# Altium project BluetoothGateway.PrjPcb
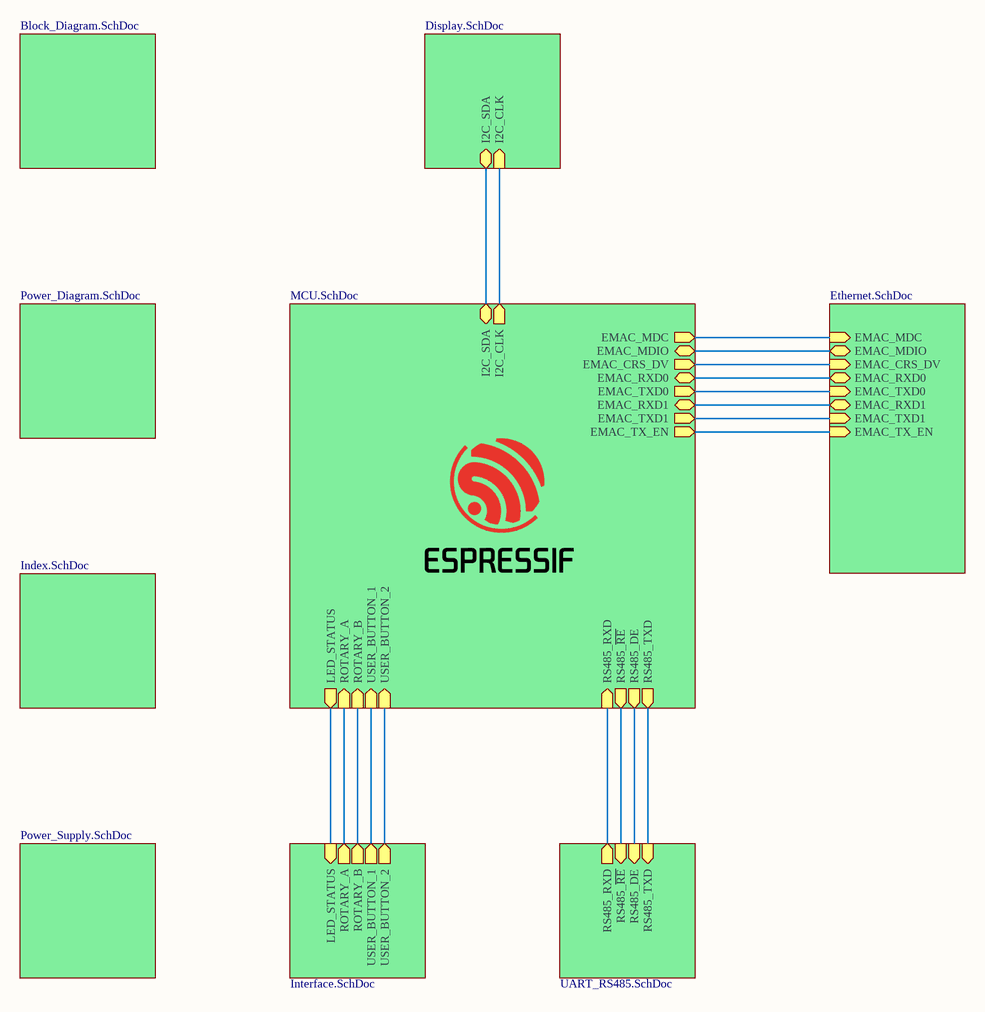
[diagram p0: Overview_Schematic.SchDoc]
10 sheets, 117 parts. Net scope: hierarchical (ports join the sheet entries above them; power ports are global).
Board file: BluetoothGateway_V1.0.0.PcbDoc
Sheets:
  Overview_Schematic.SchDoc
    Designator = Block_Diagram.SchDoc
    Designator = Power_Diagram.SchDoc
    Designator = MCU.SchDoc
    Designator = Ethernet.SchDoc
    Designator = UART_RS485.SchDoc
    Designator = Index.SchDoc
    Designator = Power_Supply.SchDoc
    Designator = Display.SchDoc
    Designator = Interface.SchDoc

## Sheet Overview_Schematic.SchDoc: Bluetooth Gateway
size A3; CheckedBy: QUOCTHANG; DrawnBy: DONGKHOA; Revision: V1.0.0; SheetNumber: 1; SheetTotal: 10

### Sub-sheets
Designator = Block_Diagram.SchDoc: no entries
Designator = Power_Diagram.SchDoc: no entries
Designator = MCU.SchDoc: EMAC_MDC (out), EMAC_MDIO (bidir), EMAC_CRS_DV (out), EMAC_RXD0 (bidir), EMAC_RXD1 (bidir), EMAC_TXD0 (out), EMAC_TXD1 (out), EMAC_TX_EN (out), I2C_SDA (bidir), I2C_CLK (out), LED_STATUS (out), ROTARY_A (in), ROTARY_B (in), USER_BUTTON_1 (in), USER_BUTTON_2 (in), RS485_RXD (in), RS485_~{RE} (out), RS485_DE (out), RS485_TXD (out)
Designator = Ethernet.SchDoc: EMAC_MDC (in), EMAC_MDIO (bidir), EMAC_CRS_DV (in), EMAC_RXD0 (bidir), EMAC_RXD1 (bidir), EMAC_TXD0 (in), EMAC_TXD1 (in), EMAC_TX_EN (in)
Designator = UART_RS485.SchDoc: RS485_RXD (out), RS485_~{RE} (in), RS485_DE (in), RS485_TXD (in)
Designator = Index.SchDoc: no entries
Designator = Power_Supply.SchDoc: no entries
Designator = Display.SchDoc: I2C_SDA (bidir), I2C_CLK (in)
Designator = Interface.SchDoc: LED_STATUS (in), ROTARY_A (out), ROTARY_B (out), USER_BUTTON_1 (out), USER_BUTTON_2 (out)

### Nets
NetC33_2: sheet Designator/USER_BUTTON_2, sheet Designator/USER_BUTTON_2
NetC34_2: sheet Designator/USER_BUTTON_1, sheet Designator/USER_BUTTON_1
NetC35_2: sheet Designator/ROTARY_B, sheet Designator/ROTARY_B
NetC36_2: sheet Designator/ROTARY_A, sheet Designator/ROTARY_A
NetJ3_1: sheet Designator/I2C_CLK, sheet Designator/I2C_CLK
NetJ3_2: sheet Designator/I2C_SDA, sheet Designator/I2C_SDA
NetR17_1: sheet Designator/EMAC_MDIO, sheet Designator/EMAC_MDIO
NetR18_1: sheet Designator/EMAC_CRS_DV, sheet Designator/EMAC_CRS_DV
NetR20_2: sheet Designator/EMAC_RXD0, sheet Designator/EMAC_RXD0
NetR21_2: sheet Designator/EMAC_RXD1, sheet Designator/EMAC_RXD1
NetR42_1: sheet Designator/LED_STATUS, sheet Designator/LED_STATUS
NetU3_8: sheet Designator/RS485_TXD, sheet Designator/RS485_TXD
NetU3_9: sheet Designator/RS485_DE, sheet Designator/RS485_DE
NetU3_10: sheet Designator/RS485_~{RE}, sheet Designator/RS485_~{RE}
NetU3_11: sheet Designator/RS485_RXD, sheet Designator/RS485_RXD
NetU3_23: sheet Designator/EMAC_TXD1, sheet Designator/EMAC_TXD1
NetU3_26: sheet Designator/EMAC_TXD0, sheet Designator/EMAC_TXD0
NetU3_30: sheet Designator/EMAC_TX_EN, sheet Designator/EMAC_TX_EN
NetU3_31: sheet Designator/EMAC_MDC, sheet Designator/EMAC_MDC

### Notes on the sheet
- Project Name
- Size
- A3
- Revision
- Checked By:
- Drawn By:
- Date:
- File:
- Last Modified:
- Sheet
- of

## Sheet Block_Diagram.SchDoc: Bluetooth Gateway
size A; CheckedBy: QUOCTHANG; DrawnBy: DONGKHOA; Revision: V1.0.0; SheetNumber: 2; SheetTotal: 10

### Notes on the sheet
- Project Name
- Size
- A4
- Revision
- Checked By:
- Drawn By:
- Date:
- File:
- Last Modified:
- Sheet
- of
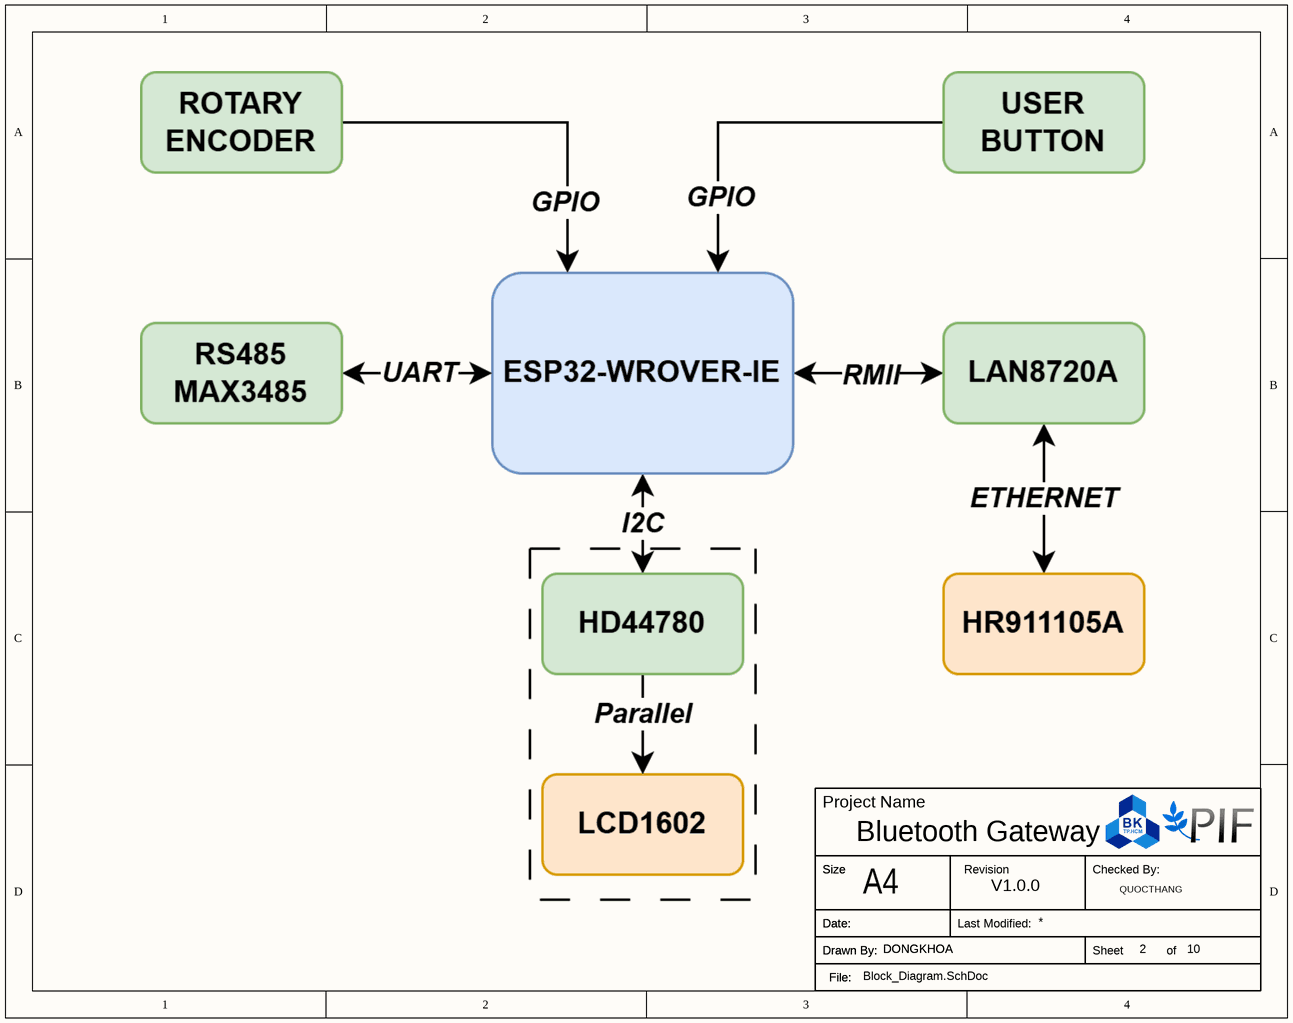
[diagram p1: Block_Diagram.SchDoc]

## Sheet Power_Diagram.SchDoc: Bluetooth Gateway
size A; CheckedBy: QUOCTHANG; DrawnBy: DONGKHOA; Revision: V1.0.0; SheetNumber: 3; SheetTotal: 10

### Notes on the sheet
- Project Name
- Size
- A4
- Revision
- Checked By:
- Drawn By:
- Date:
- File:
- Last Modified:
- Sheet
- of
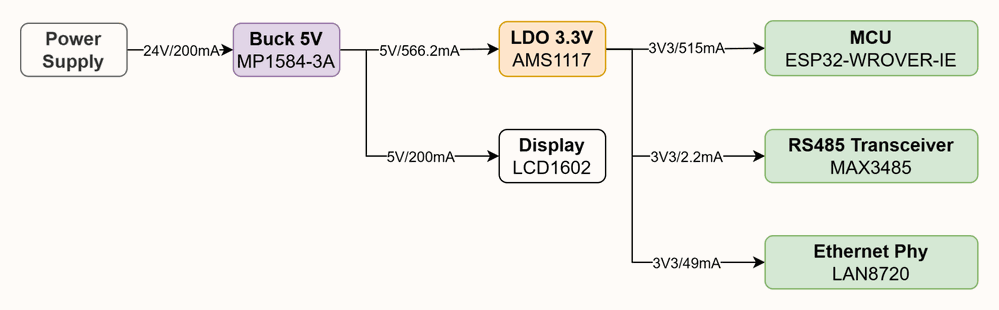
[diagram p2: Power_Diagram.SchDoc]

## Sheet MCU.SchDoc: Bluetooth Gateway
size A; CheckedBy: QUOCTHANG; DrawnBy: DONGKHOA; Revision: V1.0.0; SheetNumber: 6; SheetTotal: 10
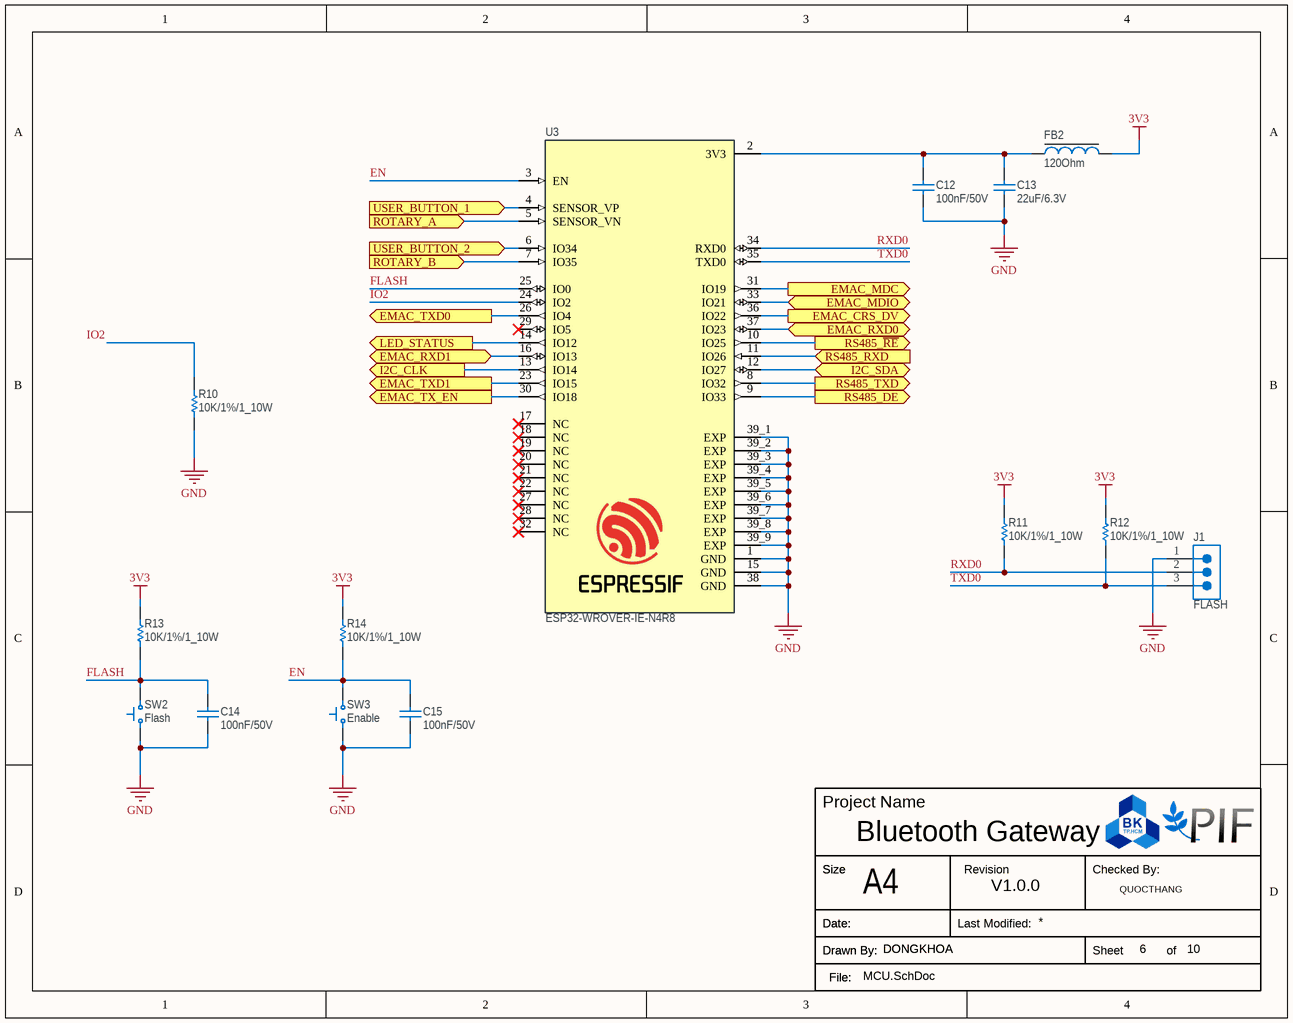
[diagram p3: MCU.SchDoc]

### Parts
C12  100nF/50V  [CAP_0805]
C13  22uF/6.3V  [CAP_0805]
C14  100nF/50V  [CAP_0603]
C15  100nF/50V  [CAP_0603]
FB2  120Ohm  [Ferrite_Bead_0805]
J1  FLASH  [Header_2.54mm_3P]
R10  10K/1%/1_10W  [Resistor_0603]
R11  10K/1%/1_10W  [Resistor_0603]
R12  10K/1%/1_10W  [Resistor_0603]
R13  10K/1%/1_10W  [Resistor_0603]
R14  10K/1%/1_10W  [Resistor_0603]
SW2  Flash  [Button_3x4mm_SMD_2P]
SW3  Enable  [Button_3x4mm_SMD_2P]
U3  ESP32-WROVER-IE-N4R8  [XCVR_ESP32-WROVER-IE-N4R8]

### Ports
EMAC_CRS_DV (out, see Overview_Schematic[5B], Ethernet[7B]), EMAC_MDC (out, see Overview_Schematic[5B], Ethernet[7B]), EMAC_MDIO (bidir, see Overview_Schematic[5B], Ethernet[7B]), EMAC_RXD0 (bidir, see Overview_Schematic[5B], Ethernet[7A]), EMAC_RXD1 (bidir, see Overview_Schematic[5B], Ethernet[7A]), EMAC_TX_EN (out, see Overview_Schematic[5B], Ethernet[7A]), EMAC_TXD0 (out, see Overview_Schematic[5B], Ethernet[7A]), EMAC_TXD1 (out, see Overview_Schematic[5B], Ethernet[7A]), I2C_CLK (out, see Overview_Schematic[4B], Display[2C]), I2C_SDA (bidir, see Overview_Schematic[4B], Display[2C]), LED_STATUS (out, see Overview_Schematic[4C], Interface[2B]), ROTARY_A (in, see Overview_Schematic[4C], Interface[1A]), ROTARY_B (in, see Overview_Schematic[4C], Interface[1A]), RS485_DE (out, see Overview_Schematic[5C], UART_RS485[1B]), RS485_RXD (in, see Overview_Schematic[5C], UART_RS485[1B]), RS485_TXD (out, see Overview_Schematic[5C], UART_RS485[1B]), RS485_~{RE} (out, see Overview_Schematic[5C], UART_RS485[1B]), USER_BUTTON_1 (in, see Overview_Schematic[4C], Interface[3A]), USER_BUTTON_2 (in, see Overview_Schematic[4C], Interface[2A])

### Nets
3V3: FB2.2 R11.2 R12.2 R13.2 R14.2
GND: C12.1 C13.1 C14.1 C15.1 J1.1 R10.1 SW2.1 SW3.1 U3.1(GND) U3.15(GND) U3.38(GND) U3.39_1(EXP) U3.39_2(EXP) U3.39_3(EXP) U3.39_4(EXP) U3.39_5(EXP) U3.39_6(EXP) U3.39_7(EXP) U3.39_8(EXP) U3.39_9(EXP)
EN: C15.2 R14.1 SW3.2 U3.3(EN)
FLASH: C14.2 R13.1 SW2.2 U3.25(IO0)
IO2: R10.2 U3.24(IO2)
RXD0: J1.2 R11.1 U3.34(RXD0)
TXD0: J1.3 R12.1 U3.35(TXD0)
NetC12_2: C12.2 C13.2 FB2.1 U3.2(3V3)
NetC33_2: U3.6(IO34) ; port USER_BUTTON_2
NetC34_2: U3.4(SENSOR_VP) ; port USER_BUTTON_1
NetC35_2: U3.7(IO35) ; port ROTARY_B
NetC36_2: U3.5(SENSOR_VN) ; port ROTARY_A
NetJ3_1: U3.13(IO14) ; port I2C_CLK
NetJ3_2: U3.12(IO27) ; port I2C_SDA
NetR17_1: U3.33(IO21) ; port EMAC_MDIO
NetR18_1: U3.36(IO22) ; port EMAC_CRS_DV
NetR20_2: U3.37(IO23) ; port EMAC_RXD0
NetR21_2: U3.16(IO13) ; port EMAC_RXD1
NetR42_1: U3.14(IO12) ; port LED_STATUS
NetU3_8: U3.8(IO32) ; port RS485_TXD
NetU3_9: U3.9(IO33) ; port RS485_DE
NetU3_10: U3.10(IO25) ; port RS485_~{RE}
NetU3_11: U3.11(IO26) ; port RS485_RXD
NetU3_23: U3.23(IO15) ; port EMAC_TXD1
NetU3_26: U3.26(IO4) ; port EMAC_TXD0
NetU3_30: U3.30(IO18) ; port EMAC_TX_EN
NetU3_31: U3.31(IO19) ; port EMAC_MDC

Not connected (* = marked no-connect by the designer): U3 17(NC)* 18(NC)* 19(NC)* 20(NC)* 21(NC)* 22(NC)* 27(NC)* 28(NC)* 29(IO5)* 32(NC)*

### Notes on the sheet
- Project Name
- Size
- A4
- Revision
- Checked By:
- Drawn By:
- Date:
- File:
- Last Modified:
- Sheet
- of

### Library data of the parts
C12 = Ceramic_Cap_100nF_50V_0805: CAP, size 0805, 100nF, 50V; Supply Part Number: Tụ Gốm 0805 100nF (0.1uF) 50V; Supply Name: Thegioiic; Datasheet: *; Supply URL: https://www.thegioiic.com/tu-gom-0805-100nf-0-1uf-50v
C13 = Ceramic_Cap_22uF_6.3V_0805: CAP, size 0805, 22uF, 6.3V; Supply Part Number: Tụ Gốm 0805 22uF 6.3V; Supply Name: Thegioiic; Datasheet: *; Supply URL: https://www.thegioiic.com/tu-gom-0805-22uf-6-3v
C14 C15 = Ceramic_Cap_100nF_50V_0603: CAP, size 0603, 100nF, 50V; Supply Part Number: Tụ Gốm 0603 100nF (0.1uF) 50V; Supply Name: Thegioiic; Datasheet: *; Supply URL: https://www.thegioiic.com/tu-gom-0603-100nf-0-1uf-50v
FB2 = Ferrite_Bead_120Ohm_2A_0805: Ferrite Bead, size 0805, 120Ohm, 2A; Supply Part Number: CBW201209U121T Ferrite Beads 2A 120 Ohm 0805; Supply Name: Thegioiic; Supply URL: https://www.thegioiic.com/cbw201209u121t-ferrite-beads-2a-120-ohm-0805
J1 = Header_2.54mm_3P: Hàng Rào Đực Đơn 2.54mm 40 Chân 1 Hàng Cao 11.2mm Xuyên Lỗ; Supply Name: Thegioiic; Supply Part Number: Hàng Rào Đực Đơn 2.54mm 40 Chân 1 Hàng Cao 11.2mm Xuyên Lỗ; Supply URL: https://www.thegioiic.com/hang-rao-duc-don-2-54mm-40-chan-1-hang-cao-11-2mm-xuyen-lo
R10-R14 = Res_10K_0603_1%: Resistor 0603 10KOhm 1% 1_10W; Supply Part Number: Điện Trở 10 KOhm 0603 1%; Supply Name: Thegioiic; Supply URL: https://www.thegioiic.com/dien-tro-10-kohm-0603-1-
SW2 SW3 = Button_SMD_3x4mm_2P: Supply Part Number: Nút Nhấn 3x4mm Cao 2.5mm 2 Chân SMD; Supply Name: Thegioiic; Datasheet: *; Supply URL: https://www.thegioiic.com/nut-nhan-3x4mm-cao-2-5mm-2-chan-smd
U3 = ESP32-WROVER-IE-N4R8: Bluetooth, WiFi 802.11b/g/n, Bluetooth v4.2 +EDR Transceiver Module 2.4GHz ~ 2.5GHz PCB Trace Surface Mount; Supply Part Number: ESP32-WROVER-IE-N4R8 Module WiFi Bluetooth 4MB Flash, 8MB PSRAM, 2.4GHz; Supply Name: Thegioiic; Datasheet: https://www.espressif.com/sites/default/files/documentation/esp32-wrover-e_esp32-wrover-ie_datasheet_en.pdf; Supply URL: https://www.thegioiic.com/esp32-wrover-ie-n4r8-module-wifi-bluetooth-4mb-flash-8mb-psram-2-4ghz

## Sheet Ethernet.SchDoc: Bluetooth Gateway
size A3; CheckedBy: QUOCTHANG; DrawnBy: DONGKHOA; Revision: V1.0.0; SheetNumber: 7; SheetTotal: 10
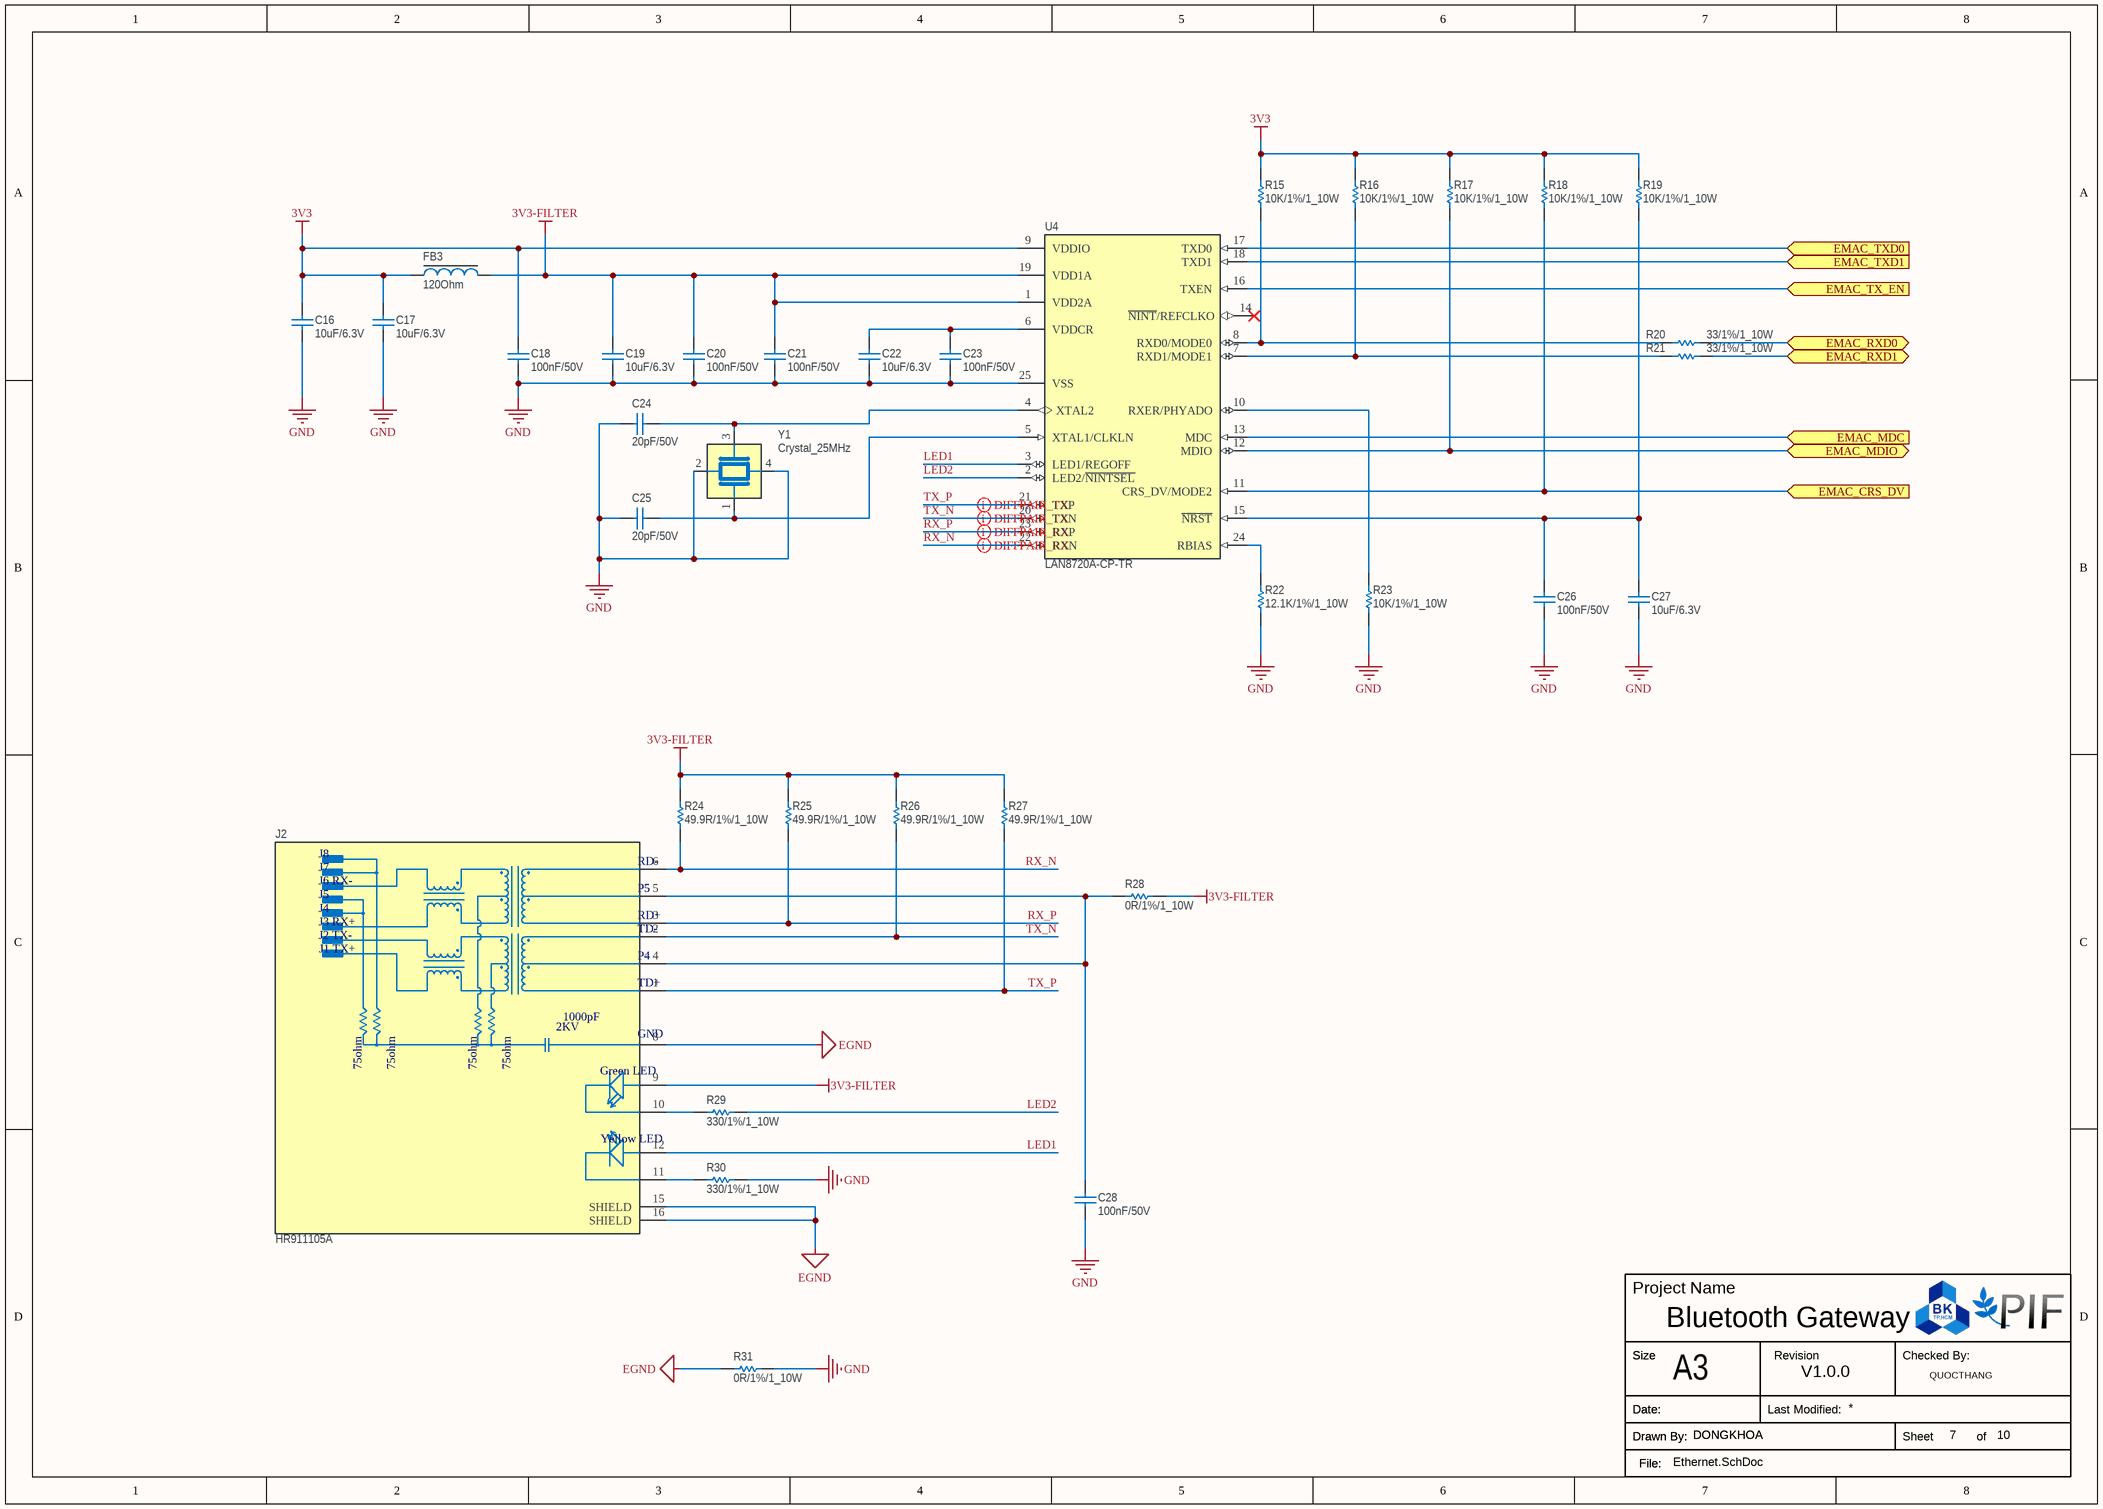
[diagram p4: Ethernet.SchDoc]

### Parts
C16  10uF/6.3V  [CAP_0603]
C17  10uF/6.3V  [CAP_0603]
C18  100nF/50V  [CAP_0603]
C19  10uF/6.3V  [CAP_0603]
C20  100nF/50V  [CAP_0603]
C21  100nF/50V  [CAP_0603]
C22  10uF/6.3V  [CAP_0603]
C23  100nF/50V  [CAP_0603]
C24  20pF/50V  [CAP_0603]
C25  20pF/50V  [CAP_0603]
C26  100nF/50V  [CAP_0603]
C27  10uF/6.3V  [CAP_0603]
C28  100nF/50V  [CAP_0603]
FB3  120Ohm  [Ferrite_Bead_0805]
J2  HR911105A  [HANRUN_HR911105A]
R15  10K/1%/1_10W  [Resistor_0603]
R16  10K/1%/1_10W  [Resistor_0603]
R17  10K/1%/1_10W  [Resistor_0603]
R18  10K/1%/1_10W  [Resistor_0603]
R19  10K/1%/1_10W  [Resistor_0603]
R20  33/1%/1_10W  [Resistor_0603]
R21  33/1%/1_10W  [Resistor_0603]
R22  12.1K/1%/1_10W  [Resistor_0603]
R23  10K/1%/1_10W  [Resistor_0603]
R24  49.9R/1%/1_10W  [Resistor_0603]
R25  49.9R/1%/1_10W  [Resistor_0603]
R26  49.9R/1%/1_10W  [Resistor_0603]
R27  49.9R/1%/1_10W  [Resistor_0603]
R28  0R/1%/1_10W  [Resistor_0603]
R29  330/1%/1_10W  [Resistor_0603]
R30  330/1%/1_10W  [Resistor_0603]
R31  0R/1%/1_10W  [Resistor_0603]
U4  LAN8720A-CP-TR  [QFN-EP-24]
Y1  Crystal_25MHz  [Crystal_SMD_3225_4P]

### Ports
EMAC_CRS_DV (in, see Overview_Schematic[6B], MCU[3B]), EMAC_MDC (in, see Overview_Schematic[6B], MCU[3B]), EMAC_MDIO (bidir, see Overview_Schematic[6B], MCU[3B]), EMAC_RXD0 (bidir, see Overview_Schematic[6B], MCU[3B]), EMAC_RXD1 (bidir, see Overview_Schematic[6B], MCU[2B]), EMAC_TX_EN (in, see Overview_Schematic[6B], MCU[2B]), EMAC_TXD0 (in, see Overview_Schematic[6B], MCU[2B]), EMAC_TXD1 (in, see Overview_Schematic[6B], MCU[2B])

### Nets
3V3: C16.2 C17.2 C18.2 FB3.1 R15.2 R16.2 R17.2 R18.2 R19.2 U4.9(VDDIO)
3V3-FILTER: C19.2 C20.2 C21.2 FB3.2 J2.9(GA) R24.2 R25.2 R26.2 R27.2 R28.2 U4.1(VDD2A) U4.19(VDD1A)
EGND: J2.8(GND) J2.15(SHIELD) J2.16(SHIELD) R31.1
GND: C16.1 C17.1 C18.1 C19.1 C20.1 C21.1 C22.1 C23.1 C24.2 C25.1 C26.1 C27.1 C28.1 R22.1 R23.1 R30.2 R31.2 U4.25(VSS) Y1.2(GND) Y1.4(GND)
LED1: J2.12(YA) U4.3(LED1/REGOFF)
LED2: R29.2 U4.2(LED2/~{NINTSEL})
RX_N: J2.6(RD-) R24.1 U4.22(RXN)
RX_P: J2.3(RD+) R25.1 U4.23(RXP)
TX_N: J2.2(TD-) R26.1 U4.20(TXN)
TX_P: J2.1(TD+) R27.1 U4.21(TXP)
NetC22_2: C22.2 C23.2 U4.6(VDDCR)
NetC24_1: C24.1 U4.4(XTAL2) Y1.3
NetC25_2: C25.2 U4.5(XTAL1/CLKLN) Y1.1
NetC26_2: C26.2 C27.2 R19.1 U4.15(~{NRST})
NetC28_2: C28.2 J2.4(P4) J2.5(P5) R28.1
NetJ2_10: J2.10(GC) R29.1
NetJ2_11: J2.11(YC) R30.1
NetR15_1: R15.1 R20.1 U4.8(RXD0/MODE0)
NetR16_1: R16.1 R21.1 U4.7(RXD1/MODE1)
NetR17_1: R17.1 U4.12(MDIO) ; port EMAC_MDIO
NetR18_1: R18.1 U4.11(CRS_DV/MODE2) ; port EMAC_CRS_DV
NetR20_2: R20.2 ; port EMAC_RXD0
NetR21_2: R21.2 ; port EMAC_RXD1
NetR22_2: R22.2 U4.24(RBIAS)
NetR23_2: R23.2 U4.10(RXER/PHYADO)
NetU3_23: U4.18(TXD1) ; port EMAC_TXD1
NetU3_26: U4.17(TXD0) ; port EMAC_TXD0
NetU3_30: U4.16(TXEN) ; port EMAC_TX_EN
NetU3_31: U4.13(MDC) ; port EMAC_MDC

Not connected (* = marked no-connect by the designer): U4 14(~{NINT}/REFCLKO)*

### Layout directives
differential pair: RX_N, RX_P, TX_N, TX_P

### Notes on the sheet
- Project Name
- Size
- A3
- Revision
- Checked By:
- Drawn By:
- Date:
- File:
- Last Modified:
- Sheet
- of
- (in symbol HR911105A) J8; J7; J6 RX-; J5; J4; J3 RX+; J2 TX-; J1 TX+; 1000pF; 75ohm; 2KV; Green LED; Yellow LED

### Library data of the parts
C16 C17 C19 C22 C27 = Ceramic_Cap_10uF_6.3V_0603: CAP, size 0603, 10uF, 6.3V; Supply Part Number: CC0603KRX5R5BB106; Supply Name: tme; Datasheet: *; Supply URL: http://www.tme.vn/Product.aspx?id=1165#page=pro_info
C18 C20 C21 C23 C26 C28 = Ceramic_Cap_100nF_50V_0603: as C14 on sheet MCU; Datasheet: *; Supply URL: https://www.thegioiic.com/tu-gom-0603-100nf-0-1uf-50v
C24 C25 = Ceramic_Cap_20pF_50V_0603: CAP, size 0603, 20pF, 50V; Supply Part Number: CC0603JRNPO9BN200; Supply Name: tme; Datasheet: *; Supply URL: http://tme.vn/Product.aspx?id=1305#page=pro_info
FB3 = Ferrite_Bead_120Ohm_2A_0805: as FB2 on sheet MCU; Supply URL: https://www.thegioiic.com/cbw201209u121t-ferrite-beads-2a-120-ohm-0805
J2 = HR911105A: DIP RJ45 Connector;; Supply Part Number: HR911105A Cổng RJ45 Cái Có LED Hanrun; Supply Name: Thegioiic; Datasheet: https://core-electronics.com.au/attachments/localcontent/cc11be56d66bb63d5f1eeb85492439c0_335950a6d06.pdf; Supply URL: https://www.thegioiic.com/hr911105a-cong-rj45-cai-co-led-hanrun
R15-R19 R23 = Res_10K_0603_1%: as R10 on sheet MCU; Supply URL: https://www.thegioiic.com/dien-tro-10-kohm-0603-1-
R20 R21 = Res_33R_0603_1%: Resistor 0603 33Ohm 1% 1_10W; Supply Part Number: Điện Trở 33 Ohm 0603 1%; Supply Name: Thegioiic; Supply URL: https://www.thegioiic.com/dien-tro-33-ohm-0603-1-
R22 = Res_12.1K_0603_1%: Resistor 0603 12.1KOhm 1% 1_10W; Supply Part Number: Điện Trở 12.1 KOhm 0603 1%; Supply Name: Thegioiic; Supply URL: https://www.thegioiic.com/dien-tro-12-1-kohm-0603-1-
R24-R27 = Res_49.9R_0603_1%: Resistor 0603 49.9 Ohm 1% 1_10W; Supply Part Number: Điện Trở 49.9 Ohm 0603 1%; Supply Name: Thegioiic; Supply URL: https://www.thegioiic.com/dien-tro-49-9-ohm-0603-1-
R28 R31 = Res_0R_0603_1%: Resistor 0603 0 Ohm 1% 1_10W; Supply Part Number: Điện Trở 0 Ohm 0603 1%; Supply Name: Thegioiic; Supply URL: https://www.thegioiic.com/dien-tro-0-ohm-0603-1-
R29 R30 = Res_330_0603_1%: Resistor 0603 330KOhm 1% 1_10W; Supply Part Number: Điện Trở 330 Ohm 0603 1%; Supply Name: Thegioiic; Supply URL: https://www.thegioiic.com/dien-tro-330-ohm-0603-1-
U4 = LAN8720A-CP-TR: PHY 1-CH 10Mbps/100Mbps 2.5V/3.3V 24-PinQFN EP Tray; Supply Part Number: LAN8720A IC Truyền Nhận Ethernet 24-QFN; Supply Name: Thegioiic; Datasheet: https://ww1.microchip.com/downloads/en/devicedoc/00002165b.pdf; Supply URL: https://www.thegioiic.com/lan8720a-ic-truyen-nhan-ethernet-24-qfn
Y1 = Crystal_25MHz: 25 MHz Crystal 4-SMD; Supply Part Number: Thạch Anh 25MHz 3225 4 Chân SMD; Supply Name: Thegioiic; Supply URL: https://www.thegioiic.com/thach-anh-25mhz-3225-4-chan-smd

## Sheet UART_RS485.SchDoc: Bluetooth Gateway
size A; CheckedBy: QUOCTHANG; DrawnBy: DONGKHOA; Revision: V1.0.0; SheetNumber: 8; SheetTotal: 10
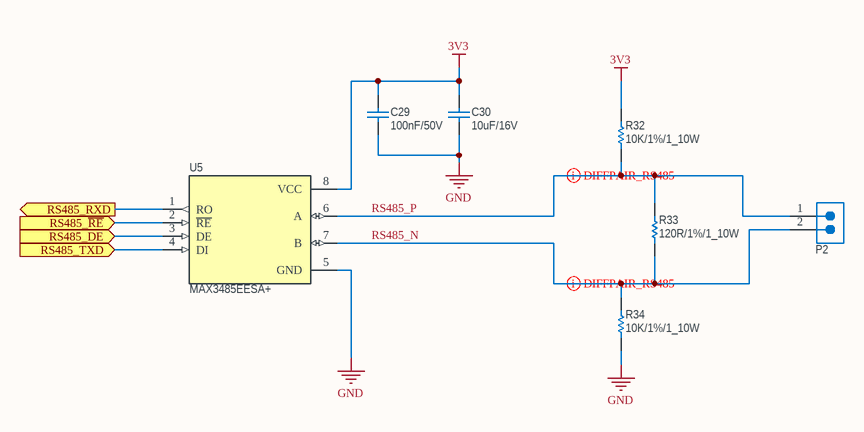
[diagram p5: UART_RS485.SchDoc]

### Parts
C29  100nF/50V  [CAP_0603]
C30  10uF/16V  [CAP_0603]
P2  3.81mm_2P  [Terminal_Block_3.81mm_2P]  (value not drawn)
R32  10K/1%/1_10W  [Resistor_0603]
R33  120R/1%/1_10W  [Resistor_0603]
R34  10K/1%/1_10W  [Resistor_0603]
U5  MAX3485EESA+  [SOIC-8]

### Ports
RS485_DE (in, see Overview_Schematic[5C], MCU[3B]), RS485_RXD (out, see Overview_Schematic[5C], MCU[3B]), RS485_TXD (in, see Overview_Schematic[5C], MCU[3B]), RS485_~{RE} (in, see Overview_Schematic[5C], MCU[3B])

### Nets
3V3: C29.2 C30.2 R32.2 U5.8(VCC)
GND: C29.1 C30.1 R34.2 U5.5(GND)
RS485_N: P2.2 R33.1 R34.1 U5.7(B)
RS485_P: P2.1 R32.1 R33.2 U5.6(A)
NetU3_8: U5.4(DI) ; port RS485_TXD
NetU3_9: U5.3(DE) ; port RS485_DE
NetU3_10: U5.2(~{RE}) ; port RS485_~{RE}
NetU3_11: U5.1(RO) ; port RS485_RXD

### Layout directives
differential pair: RS485_N, RS485_P

### Notes on the sheet
- Project Name
- Size
- A4
- Revision
- Checked By:
- Drawn By:
- Date:
- File:
- Last Modified:
- Sheet
- of

### Library data of the parts
C29 = Ceramic_Cap_100nF_50V_0603: as C14 on sheet MCU; Datasheet: *; Supply URL: https://www.thegioiic.com/tu-gom-0603-100nf-0-1uf-50v
C30 = Ceramic_Cap_10uF_16V_0603: CAP, size 0603, 10uF, 16V; Supply Part Number: Tụ Gốm 0603 10uF 16V; Supply Name: Thegioiic; Datasheet: *; Supply URL: https://www.thegioiic.com/tu-gom-0603-10uf-16v
P2 = Terminal_Block_3.81mm_2P: Terminal Block THT, pitch 3.81mm, 2p, 300V, 10A; Supply Part Number: UL-3.81-2-R Terminal Block Plug-in Hàn PCB 2 Chân Cong 3.81mm 300V 10A ULO; Supply Name: Thegioiic; Supply URL: https://www.thegioiic.com/ul-3-81-2-r-terminal-block-plug-in-han-pcb-2-chan-cong-3-81mm-300v-10a-ulo
R32 R34 = Res_10K_0603_1%: as R10 on sheet MCU; Supply URL: https://www.thegioiic.com/dien-tro-10-kohm-0603-1-
R33 = Res_120R_0603_1%: Resistor 0603 120 Ohm 1% 1_10W; Supply Part Number: Điện Trở 120 Ohm 0603 1%; Supply Name: Thegioiic; Supply URL: https://www.thegioiic.com/dien-tro-120-ohm-0603-1-
U5 = MAX3485EESA+: 1/1 Transceiver Half RS422, RS485 8-SOIC; Supply Part Number: MAX3485EESA+ Line Transceiver, 8-SOIC; Supply Name: Thegioiic; Datasheet: https://www.analog.com/media/en/technical-documentation/data-sheets/max3483e-max3491e.pdf; Supply URL: https://www.thegioiic.com/max3485eesa-line-transceiver-8-soic

## Sheet Index.SchDoc: Bluetooth Gateway
size A; CheckedBy: QUOCTHANG; DrawnBy: DONGKHOA; Revision: V1.0.0; SheetNumber: 4; SheetTotal: 10
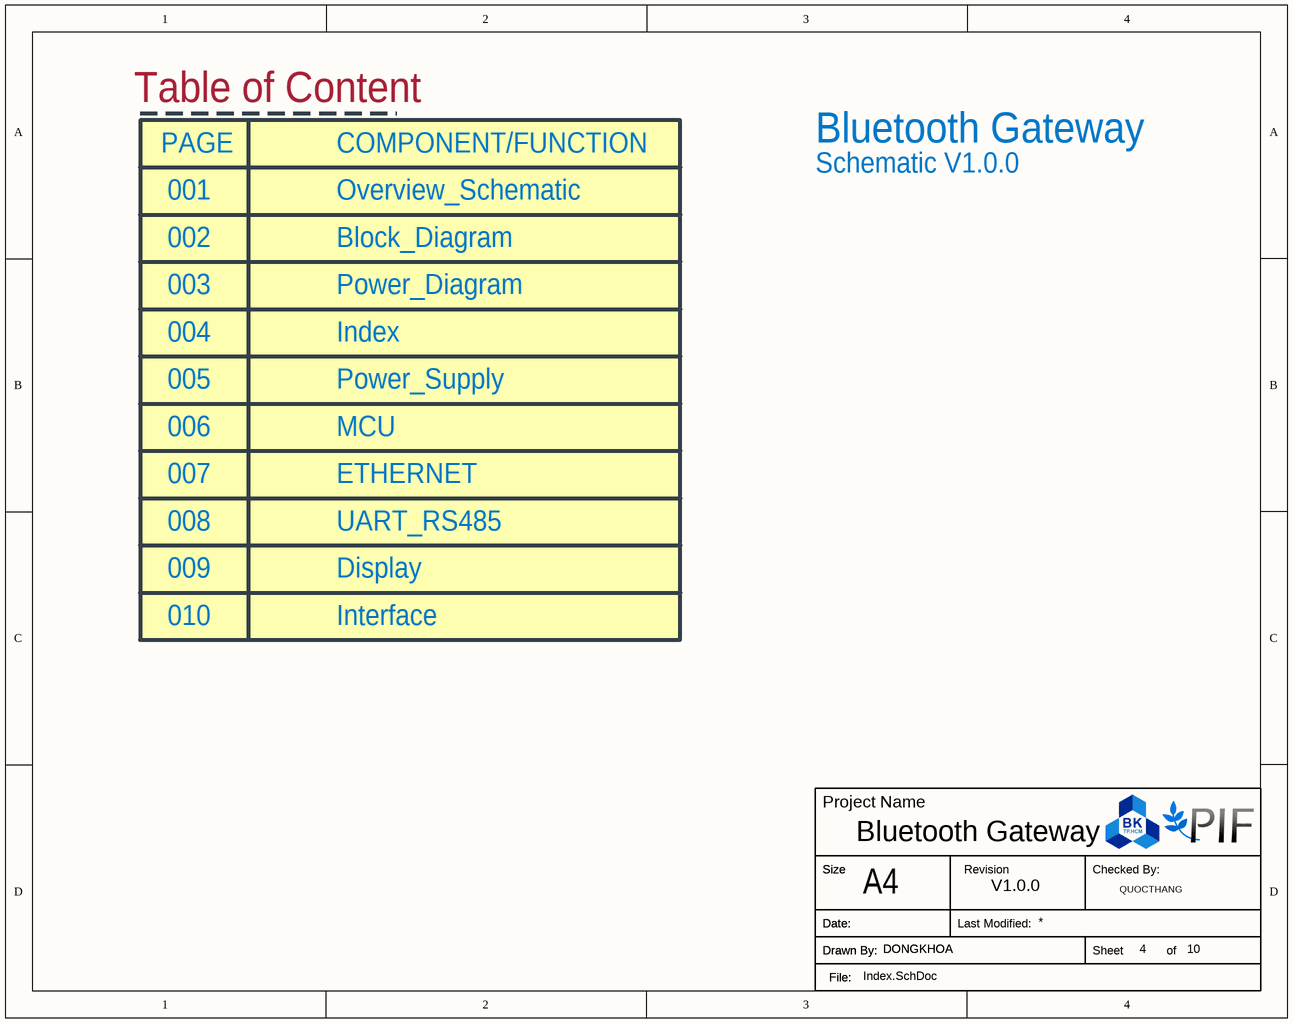
[diagram p6: Index.SchDoc]

### Notes on the sheet
- Table of Content
- PAGE
- COMPONENT/FUNCTION
- Bluetooth Gateway
- 001
- Overview_Schematic
- Schematic V1.0.0
- 002
- 003
- Block_Diagram
- Power_Diagram
- 004
- Index
- 005
- Power_Supply
- 006
- 007
- MCU
- ETHERNET
- 008
- UART_RS485
- 009
- 010
- Display
- Interface
- Project Name
- Size
- A4
- Revision
- Checked By:
- Drawn By:
- Date:
- File:
- Last Modified:
- Sheet
- of

## Sheet Power_Supply.SchDoc: Bluetooth Gateway
size A3; CheckedBy: QUOCTHANG; DrawnBy: DONGKHOA; Revision: V1.0.0; SheetNumber: 5; SheetTotal: 10
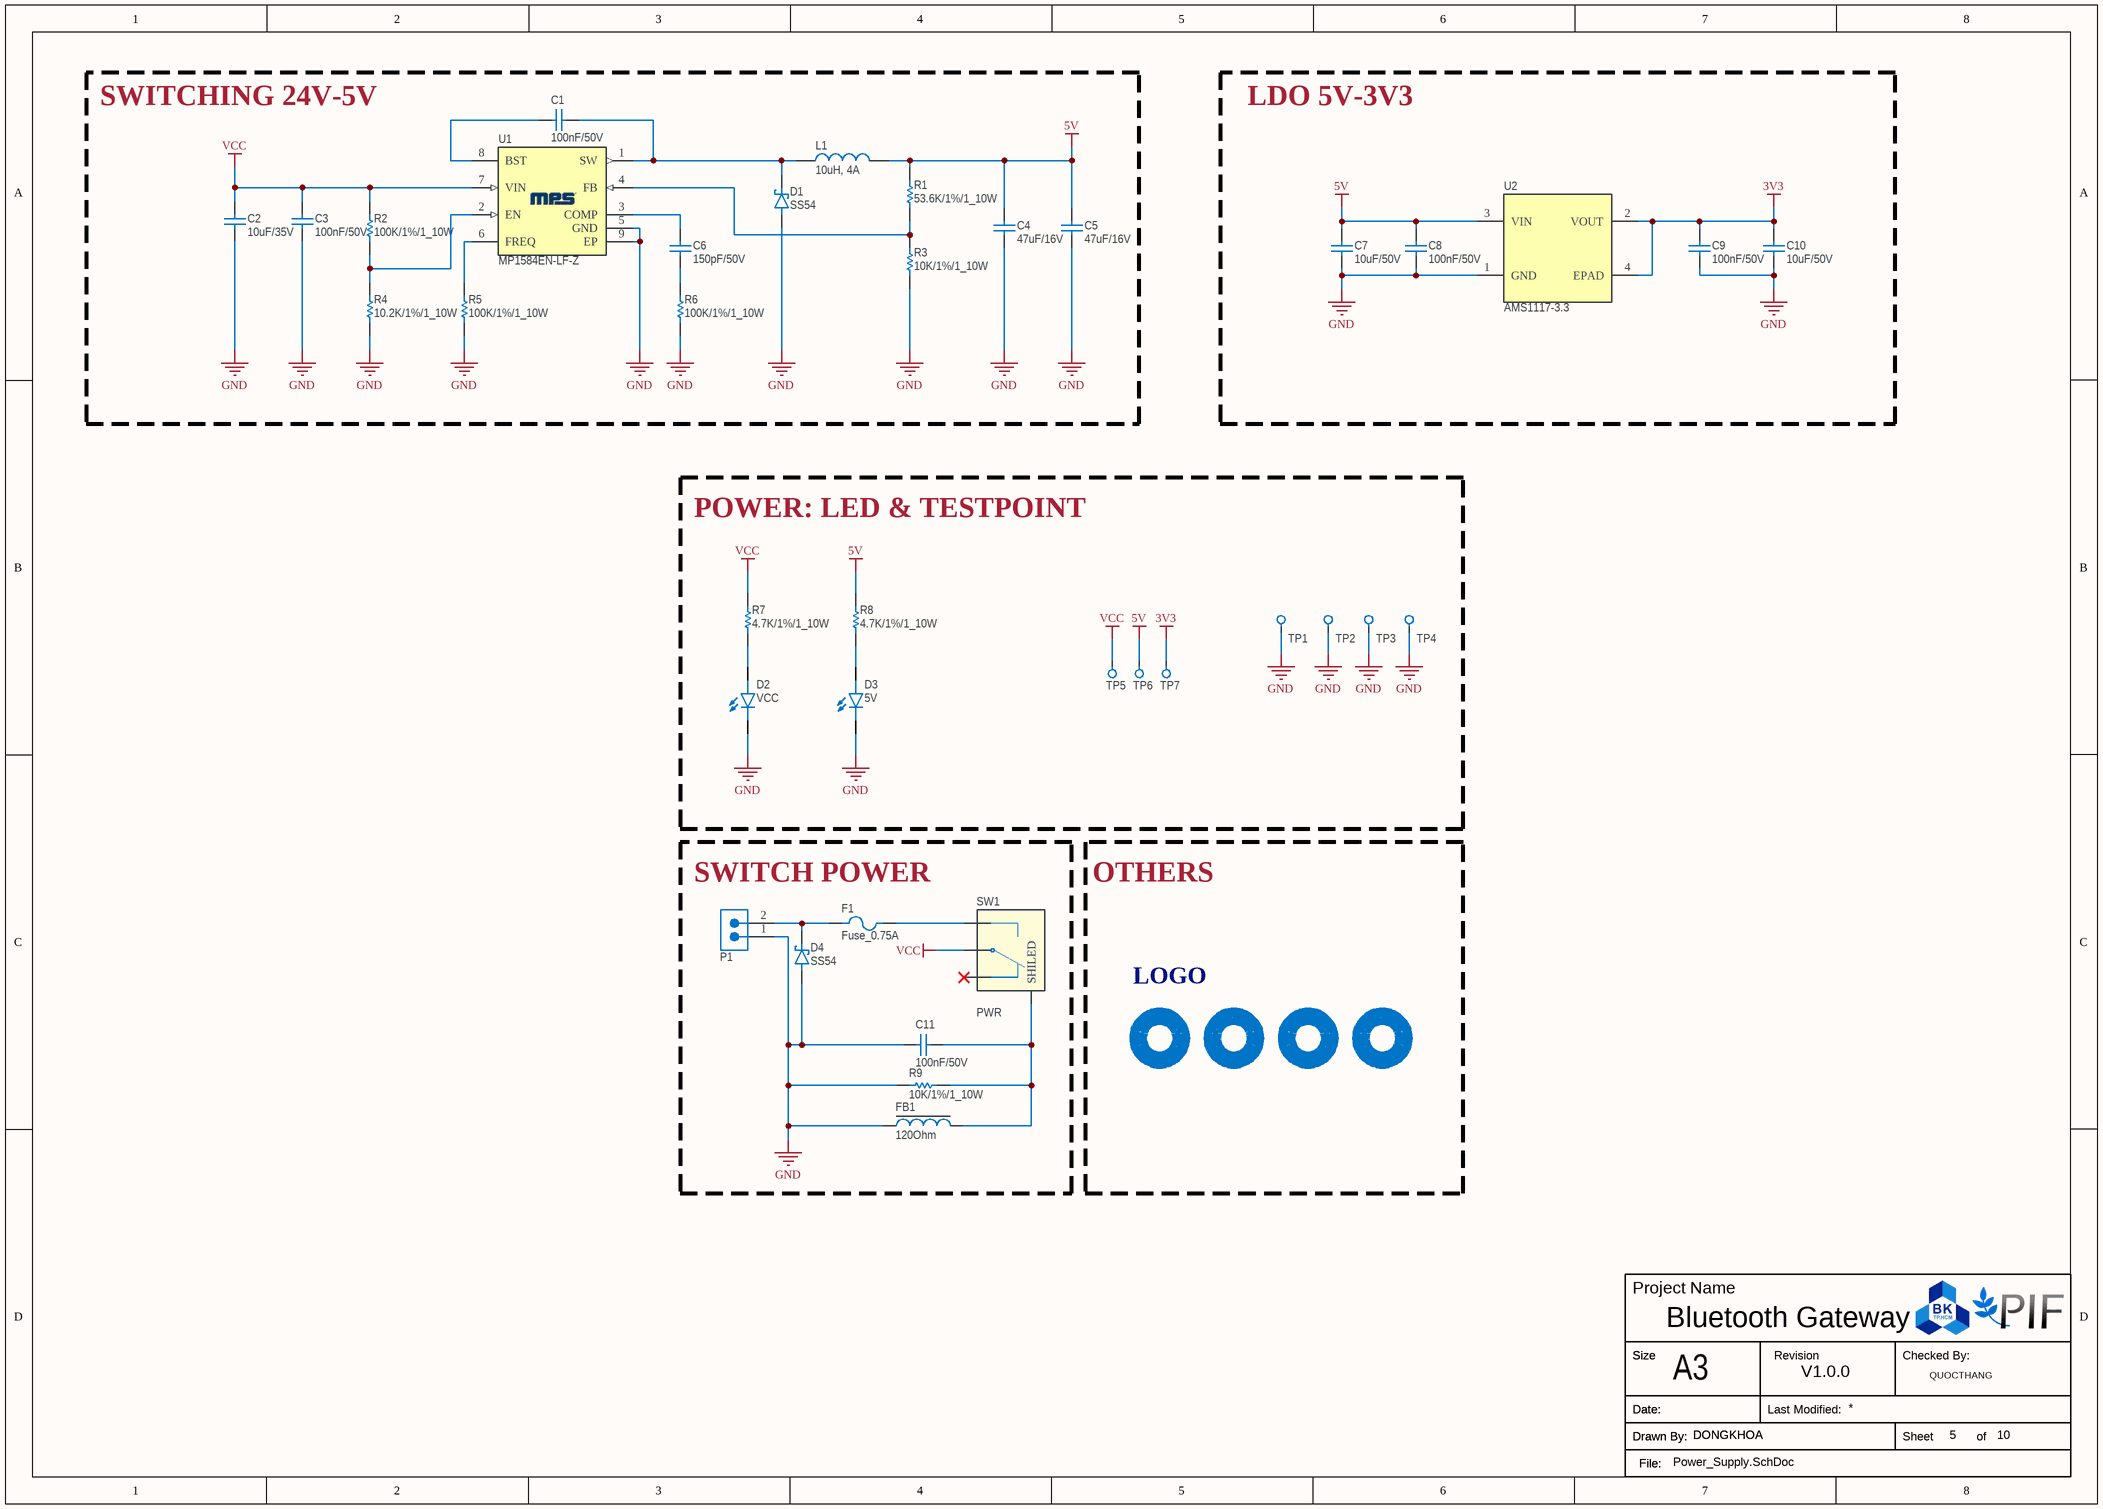
[diagram p7: Power_Supply.SchDoc]

### Parts
*1  LOGO  [BK_LOGO]  (value not drawn)
C1  100nF/50V  [CAP_0603]
C2  10uF/35V  [CAP_1206]
C3  100nF/50V  [CAP_1206]
C4  47uF/16V  [CAP_1206]
C5  47uF/16V  [CAP_1206]
C6  150pF/50V  [CAP_0603]
C7  10uF/50V  [CAP_0805]
C8  100nF/50V  [CAP_0805]
C9  100nF/50V  [CAP_0805]
C10  10uF/50V  [CAP_0805]
C11  100nF/50V  [CAP_0603]
D1  SS54  [D_SMA]
D2  VCC  [LED_0603Y]
D3  5V  [LED_0603Y]
D4  SS54  [D_SMA]
F1  Fuse_0.75A  [FUSER_MF-MSMF075/24-2]
FB1  120Ohm  [Ferrite_Bead_0805]
H1  Mounting Hole without connection  [MountingHole_3.2mm_M3_Pad_Via]  (value not drawn)
H2  Mounting Hole without connection  [MountingHole_3.2mm_M3_Pad_Via]  (value not drawn)
H3  Mounting Hole without connection  [MountingHole_3.2mm_M3_Pad_Via]  (value not drawn)
H4  Mounting Hole without connection  [MountingHole_3.2mm_M3_Pad_Via]  (value not drawn)
L1  10uH, 4A  [Inductor_0630]
P1  5.08mm_2P  [Terminal_Block_5.08mm_2P]  (value not drawn)
R1  53.6K/1%/1_10W  [Resistor_0603]
R2  100K/1%/1_10W  [Resistor_0603]
R3  10K/1%/1_10W  [Resistor_0603]
R4  10.2K/1%/1_10W  [Resistor_0603]
R5  100K/1%/1_10W  [Resistor_0603]
R6  100K/1%/1_10W  [Resistor_0603]
R7  4.7K/1%/1_10W  [Resistor_0603]
R8  4.7K/1%/1_10W  [Resistor_0603]
R9  10K/1%/1_10W  [Resistor_0603]
SW1  PWR  [MTS-102-C3]
TP1  GND  [TestPoint_Pad_3.0x3.0mm]  (value not drawn)
TP2  GND1  [TestPoint_Pad_3.0x3.0mm]  (value not drawn)
TP3  GND2  [TestPoint_Pad_3.0x3.0mm]  (value not drawn)
TP4  GND3  [TestPoint_Pad_3.0x3.0mm]  (value not drawn)
TP5  VCC  [TestPoint_Pad_3.0x3.0mm]  (value not drawn)
TP6  5V  [TestPoint_Pad_3.0x3.0mm]  (value not drawn)
TP7  3V3  [TestPoint_Pad_3.0x3.0mm]  (value not drawn)
U1  MP1584EN-LF-Z  [SOIC-8E]
U2  AMS1117-3.3  [SOT-223]

### Blocks framed on the sheet
SWITCHING 24V-5V: C1-C6 D1 L1 R1-R6 U1
LDO 5V-3V3: C7-C10 U2
POWER: LED & TESTPOINT: D2 D3 R7 R8 TP1-TP7
SWITCH POWER: C11 D4 F1 FB1 P1 R9 SW1
OTHERS: *1 H1-H4

### Nets
3V3: C9.2 C10.2 TP7.1 U2.2(VOUT) U2.4(EPAD)
5V: C4.2 C5.2 C7.2 C8.2 L1.2 R1.2 R8.2 TP6.1 U2.3(VIN)
GND: C2.1 C3.1 C4.1 C5.1 C7.1 C8.1 C9.1 C10.1 C11.2 D1.2(A) D2.C D3.C D4.2(A) FB1.2 P1.1 R3.1 R4.1 R5.1 R6.1 R9.1 TP1.1 TP2.1 TP3.1 TP4.1 U1.5(GND) U1.9(EP) U2.1(GND)
VCC: C2.2 C3.2 R2.2 R7.2 SW1.2 TP5.1 U1.7(VIN)
NetC1_1: C1.1 U1.8(BST)
NetC1_2: C1.2 D1.1(C) L1.1 U1.1(SW)
NetC6_1: C6.1 R6.2
NetC6_2: C6.2 U1.3(COMP)
NetC11_1: C11.1 FB1.1 R9.2 SW1.SH(SHILED)
NetD2_A: D2.A R7.1
NetD3_A: D3.A R8.1
NetD4_1: D4.1(C) F1.1 P1.2
NetF1_2: F1.2 SW1.3
NetR1_1: R1.1 R3.2 U1.4(FB)
NetR2_1: R2.1 R4.2 U1.2(EN)
NetR5_2: R5.2 U1.6(FREQ)

Not connected (* = marked no-connect by the designer): SW1 1*

### Notes on the sheet
- Project Name
- Size
- A3
- Revision
- Checked By:
- Drawn By:
- Date:
- File:
- Last Modified:
- Sheet
- of

### Library data of the parts
C1 C11 = Ceramic_Cap_100nF_50V_0603: as C14 on sheet MCU; Datasheet: *; Supply URL: https://www.thegioiic.com/tu-gom-0603-100nf-0-1uf-50v
C2 = Ceramic_Cap_10uF_35V_1206: CAP, size 1206, 10uF, 35V; Supply Part Number: Tụ Gốm 1206 10uF 35V; Supply Name: Thegioiic; Datasheet: *; Supply URL: https://www.thegioiic.com/tu-gom-1206-10uf-35v
C3 = Ceramic_Cap_100nF_50V_1206: CAP, size 1206, 100nF, 50V; Supply Part Number: Tụ Gốm 1206 100nF (0.1uF) 50V; Supply Name: Thegioiic; Datasheet: *; Supply URL: https://www.thegioiic.com/tu-gom-1206-100nf-0-1uf-50v
C4 C5 = Ceramic_Cap_47uF_16V_1206: CAP, size 1206, 47uF, 16V; Supply Part Number: Tụ Gốm 1206 47uF 16V; Supply Name: Thegioiic; Datasheet: *; Supply URL: https://www.thegioiic.com/tu-gom-1206-47uf-16v
C6 = Ceramic_Cap_150pF_50V_0603: CAP, size 0603, 150pF, 50V; Supply Part Number: Tụ Gốm 0603 150pF 50V; Supply Name: Thegioiic; Datasheet: *; Supply URL: https://www.thegioiic.com/tu-gom-0603-150pf-50v
C7 C10 = Ceramic_Cap_10uF_50V_0805: CAP, size 0805, 10uF, 50V; Supply Part Number: Tụ Gốm 0805 10uF 50V; Supply Name: Thegioiic; Datasheet: *; Supply URL: https://www.thegioiic.com/tu-gom-0805-10uf-50v
C8 C9 = Ceramic_Cap_100nF_50V_0805: as C12 on sheet MCU; Datasheet: *; Supply URL: https://www.thegioiic.com/tu-gom-0805-100nf-0-1uf-50v
D1 D4 = Diode_SS54: Diode Schottky 40V 5A Surface Mount SMA; Supply Part Number: SS54 SMA Diode Shotky 5A 40V; Supply Name: Thegioiic; Datasheet: https://www.thegioiic.com/upload/documents/dc8a63b3eda4738bc390d9dc570a4e18.pdf; Supply URL: https://www.thegioiic.com/ss54-sma-diode-shotky-5a-40v
D2 D3 = LED_Yellow_0603: LED Yellow 0603; Supply Part Number: LED Vàng 0603 Dán SMD Trong Suốt Harvatek; Supply Name: Thegioiic; Supply URL: https://www.thegioiic.com/led-vang-0603-dan-smd-trong-suot-harvatek
F1 = Fuse_24V_0.75A_1812: MF-MSMF075/24-2 Cầu Chì Tự Phục Hồi 1812 24V 0.75A; Supply Name: Thegioiic; Datasheet: https://www.bourns.com/docs/product-datasheets/mf-msmf.pdf?sfvrsn=4a75e5c0_64; Supply Part Number: MF-MSMF075/24-2 Cầu Chì Tự Phục Hồi 1812 24V 0.75A; Supply URL: https://www.thegioiic.com/mf-msmf075-24-2-cau-chi-tu-phuc-hoi-1812-24v-0-75a
FB1 = Ferrite_Bead_120Ohm_2A_0805: as FB2 on sheet MCU; Supply URL: https://www.thegioiic.com/cbw201209u121t-ferrite-beads-2a-120-ohm-0805
H1-H4 = MountingHole: Datasheet: *; Supply Name: *; Supply Part Number: *; Supply URL: *
L1 = IND_10uH_0630: 10uH, 4A, Size 0630; Supply Part Number: Cuộn cảm 10UH 0630; Supply Name: icdayroi; Supply URL: https://icdayroi.com/cuon-cam-10uh-0630
P1 = Terminal_Block_5.08mm_2P: Terminal Block THT, pitch 5.08mm, 2p, 300V, 10A; Supply Part Number: UL-5.08-2-R Terminal Block Plug-in Hàn PCB 2 Chân Cong 5.08mm 300V 15A ULO; Supply Name: Thegioiic; Supply URL: https://www.thegioiic.com/ul-5-08-2-r-terminal-block-plug-in-han-pcb-2-chan-cong-5-08mm-300v-15a-ulo
R1 = Res_53.6K_0603_1%: Resistor 0603 53.6KOhm 1% 1_10W; Supply Part Number: Điện Trở 53.6 KOhm 0603 1%; Supply Name: Thegioiic; Supply URL: https://www.thegioiic.com/dien-tro-53-6-kohm-0603-1-
R2 R5 R6 = Res_100K_0603_1%: Resistor 0603 100KOhm 1% 1_10W; Supply Part Number: Điện Trở 100 KOhm 0603 1%; Supply Name: Thegioiic; Supply URL: https://www.thegioiic.com/dien-tro-100-kohm-0603-1-
R3 R9 = Res_10K_0603_1%: as R10 on sheet MCU; Supply URL: https://www.thegioiic.com/dien-tro-10-kohm-0603-1-
R4 = Res_10.2K_0603_1%: Resistor 0603 10.2KOhm 1% 1_10W; Supply Part Number: Điện Trở 10.2 KOhm 0603 1%; Supply Name: Thegioiic; Supply URL: https://www.thegioiic.com/dien-tro-10-2-kohm-0603-1-
R7 R8 = Res_4.7K_0603_1%: Resistor 0603 4.7KOhm 1% 1_10W; Supply Part Number: Điện Trở 4.7 KOhm 0603 1%; Supply Name: Thegioiic; Supply URL: https://www.thegioiic.com/dien-tro-4-7-kohm-0603-1-
SW1 = MTS-102-C3: Switch Toggle; Supply Part Number: MTS-102-C3 Công Tắc Toggle ON-ON Gạt Giữ 3 Chân Cong 6A 125VAC; Supply Name: Thegioiic; Datasheet: *; Supply URL: https://www.thegioiic.com/mts-102-c3-cong-tac-toggle-on-on-gat-giu-3-chan-cong-6a-125vac
TP1-TP7 = Testpoint_SMD: Datasheet: *; Supply Name: *; Supply Part Number: *; Supply URL: *
U1 = MP1584EN-LF-Z: Buck Switching Regulator IC Positive Adjustable 0.8V 1 Output 3A 8-SOIC _0.154, 3.90mm Width_ Exposed Pad; Supply Name: tme; Datasheet: https://www.monolithicpower.com/en/documentview/productdocument/index/version/2/document_type/Datasheet/lang/en/sku/MP1584EN-LF-Z/document_id/204/?srsltid=AfmBOopCyUDyOs-uLll4YtNPir4o4STehG4B04EkgGGTflYW96m-OPS4; Supply Part Number: MP1584EN-LF-Z; Supply URL: http://www.tme.vn/Product.aspx?id=2070#page=pro_info
U2 = AMS1117-3.3: No Description Available; Supply Name: tme; Datasheet: http://www.advanced-monolithic.com/pdf/ds1117.pdf; Supply Part Number: AMS1117-3.3; Supply URL: http://tme.vn/Product.aspx?id=437#page=pro_info

## Sheet Display.SchDoc: Bluetooth Gateway
size A; CheckedBy: QUOCTHANG; DrawnBy: DONGKHOA; Revision: V1.0.0; SheetNumber: 9; SheetTotal: 10
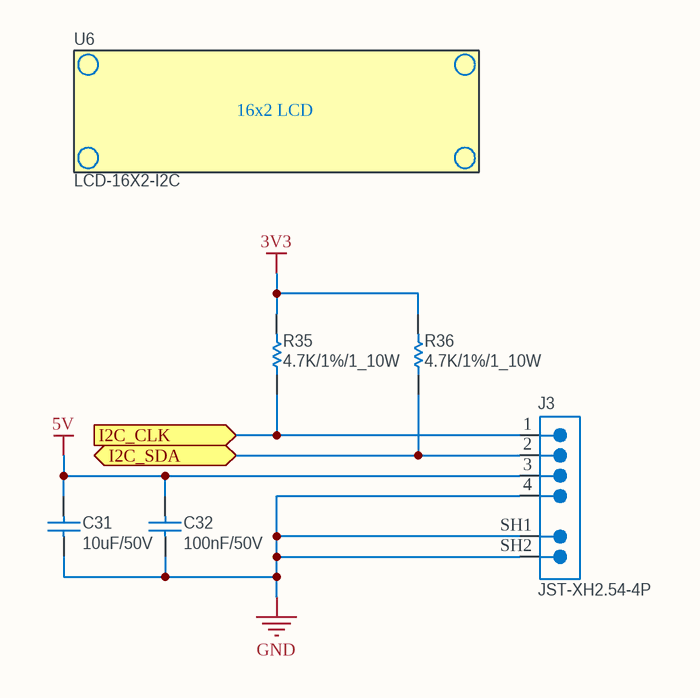
[diagram p8: Display.SchDoc]

### Parts
C31  10uF/50V  [CAP_0805]
C32  100nF/50V  [CAP_0805]
J3  JST-XH2.54-4P  [JST-XH2.54-4P]
R35  4.7K/1%/1_10W  [Resistor_0603]
R36  4.7K/1%/1_10W  [Resistor_0603]
U6  LCD-16X2-I2C  [MODULE_LCD-16X2]

### Ports
I2C_CLK (in, see Overview_Schematic[4A], MCU[2B]), I2C_SDA (bidir, see Overview_Schematic[4A], MCU[3B])

### Nets
3V3: R35.2 R36.2
5V: C31.2 C32.2 J3.3
GND: C31.1 C32.1 J3.4 J3.SH1(SHIELD) J3.SH2(SHIELD)
NetJ3_1: J3.1 R35.1 ; port I2C_CLK
NetJ3_2: J3.2 R36.1 ; port I2C_SDA

### Notes on the sheet
- Project Name
- Size
- A4
- Revision
- Checked By:
- Drawn By:
- Date:
- File:
- Last Modified:
- Sheet
- of
- (in symbol LCD-16X2-I2C) 16x2 LCD

### Library data of the parts
C31 = Ceramic_Cap_10uF_50V_0805: as C7 on sheet Power_Supply; Datasheet: *; Supply URL: https://www.thegioiic.com/tu-gom-0805-10uf-50v
C32 = Ceramic_Cap_100nF_50V_0805: as C12 on sheet MCU; Datasheet: *; Supply URL: https://www.thegioiic.com/tu-gom-0805-100nf-0-1uf-50v
J3 = JST-XH2.54-4P: XH2.54mm 4 Pin, SMD; Supply Part Number: Đầu XH2.54mm 4 Chân Dán SMD Nằm Ngang; Supply Name: Thegioiic; Supply URL: https://www.thegioiic.com/dau-xh2-54mm-4-chan-dan-smd-nam-ngang
R35 R36 = Res_4.7K_0603_1%: as R7 on sheet Power_Supply; Supply URL: https://www.thegioiic.com/dien-tro-4-7-kohm-0603-1-
U6 = LCD-16X2-I2C: Display Development Tools 16x2 Black on Green Char LCD w Backlight; Supply Part Number: LCD 1602 Nền Xanh Lá Chữ Đen 5V Kèm I2C Driver; Supply Name: Thegioiic; Datasheet: https://www.snapeda.com/parts/LCD-16X2/Gravitech/view-part/?ref=snap; Supply URL: https://www.thegioiic.com/lcd-1602-nen-xanh-la-chu-den-5v-kem-i2c-driver

## Sheet Interface.SchDoc: Bluetooth Gateway
size A; CheckedBy: QUOCTHANG; DrawnBy: DONGKHOA; Revision: V1.0.0; SheetNumber: 10; SheetTotal: 10
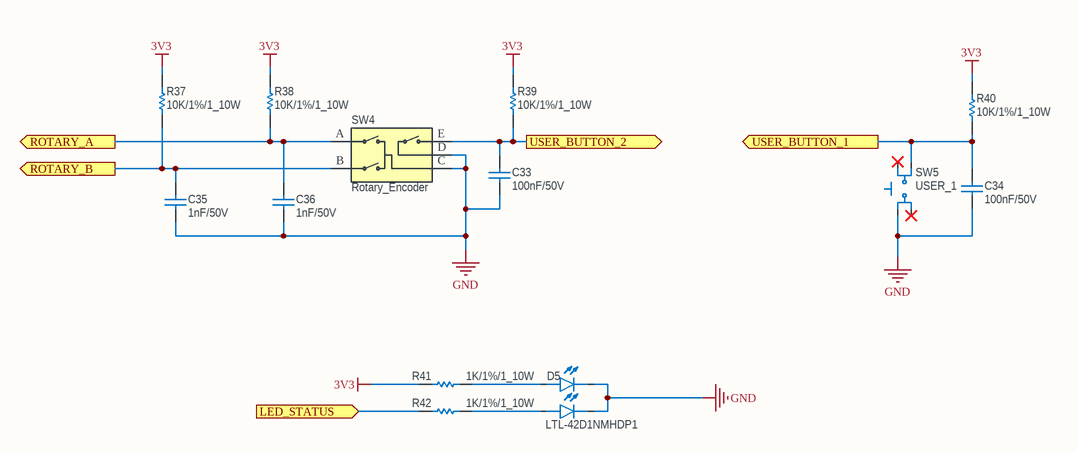
[diagram p9: Interface.SchDoc]

### Parts
C33  100nF/50V  [CAP_0603]
C34  100nF/50V  [CAP_0603]
C35  1nF/50V  [CAP_0603]
C36  1nF/50V  [CAP_0603]
D5  LTL-42D1NMHDP1  [LTL42D1NMHDP1]
R37  10K/1%/1_10W  [Resistor_0603]
R38  10K/1%/1_10W  [Resistor_0603]
R39  10K/1%/1_10W  [Resistor_0603]
R40  10K/1%/1_10W  [Resistor_0603]
R41  1K/1%/1_10W  [Resistor_0603]
R42  1K/1%/1_10W  [Resistor_0603]
SW4  Rotary_Encoder  [EC11E_AAL]
SW5  USER_1  [SW_B3F-4050_OMR]

### Ports
LED_STATUS (in, see Overview_Schematic[4C], MCU[2B]), ROTARY_A (out, see Overview_Schematic[4C], MCU[2A]), ROTARY_B (out, see Overview_Schematic[4C], MCU[2B]), USER_BUTTON_1 (out, see Overview_Schematic[4C], MCU[2A]), USER_BUTTON_2 (out, see Overview_Schematic[4C], MCU[2A])

### Nets
3V3: R37.2 R38.2 R39.2 R40.2 R41.1
GND: C33.1 C34.1 C35.1 C36.1 D5.1(K_1) D5.3(K_2) SW4.C SW4.D SW5.3
NetC33_2: C33.2 R39.1 SW4.E ; port USER_BUTTON_2
NetC34_2: C34.2 R40.1 SW5.2 ; port USER_BUTTON_1
NetC35_2: C35.2 R37.1 SW4.B ; port ROTARY_B
NetC36_2: C36.2 R38.1 SW4.A ; port ROTARY_A
NetD5_2: D5.2(A_1) R41.2
NetD5_4: D5.4(A_2) R42.2
NetR42_1: R42.1 ; port LED_STATUS

Not connected (* = marked no-connect by the designer): SW5 1* 4*

### Notes on the sheet
- Project Name
- Size
- A4
- Revision
- Checked By:
- Drawn By:
- Date:
- File:
- Last Modified:
- Sheet
- of

### Library data of the parts
C33 C34 = Ceramic_Cap_100nF_50V_0603: as C14 on sheet MCU; Datasheet: *; Supply URL: https://www.thegioiic.com/tu-gom-0603-100nf-0-1uf-50v
C35 C36 = Ceramic_Cap_1nF_50V_0603: CAP, size 0603, 1nF, 50V; Supply Part Number: CC0603KRX7R9BB102; Supply Name: tme; Datasheet: *; Supply URL: http://tme.vn/Product.aspx?id=1218#page=pro_info
D5 = LTL-42D1NMHDP1: 2 LED 3mm, xuyên lỗ; Supply Part Number: Bộ Chỉ Thị 2 LED Xanh lá-Đỏ 3mm Đế Nhựa Hàn PCB; Supply Name: Thegioiic; Supply URL: https://www.thegioiic.com/bo-chi-thi-2-led-xanh-la-do-3mm-de-nhua-han-pcb
R37-R40 = Res_10K_0603_1%: as R10 on sheet MCU; Supply URL: https://www.thegioiic.com/dien-tro-10-kohm-0603-1-
R41 R42 = Res_1K_0603_1%: Resistor 0603 1KOhm 1% 1_10W; Supply Part Number: Điện Trở 1 KOhm 0603 1%; Supply Name: Thegioiic; Supply URL: https://www.thegioiic.com/dien-tro-1-kohm-0603-1-
SW4 = Rotary_Encoder: No Description Available; Supply Part Number: EC11 Rotary Encoder 20 Vị Trí 15mm; Supply Name: Thegioiic; Datasheet: https://www.mouser.com/datasheet/2/15/EC11-1370808.pdf?srsltid=AfmBOorL-p3RDg0TVWdiqS1ahAZMuYN-p-HqCGniHXWN9SXXGVQbWXfM; Supply URL: https://www.thegioiic.com/ec11-rotary-encoder-20-vi-tri-15mm
SW5 = Button_B3F-4055: No Description Available; Supply Part Number: B3F-4055 Nút Nhấn 12x12mm Cao 7.3mm 4 Chân Xuyên Lỗ Omron; Supply Name: Thegioiic; Datasheet: *; Supply URL: https://www.thegioiic.com/b3f-4055-nut-nhan-12x12mm-cao-7-3mm-4-chan-xuyen-lo-omron

## Nets that join several sheets
3V3: MCU (5 pins), Ethernet (10 pins), UART_RS485 (C29.2 C30.2 R32.2 U5.8), Power_Supply (5 pins), Display (R35.2 R36.2), Interface (5 pins)
5V: Power_Supply (9 pins), Display (C31.2 C32.2 J3.3)
GND: MCU (20 pins), Ethernet (20 pins), UART_RS485 (C29.1 C30.1 R34.2 U5.5), Power_Supply (27 pins), Display (5 pins), Interface (9 pins)
NetC33_2: MCU (U3.6), Interface (C33.2 R39.1 SW4.E)
NetC34_2: MCU (U3.4), Interface (C34.2 R40.1 SW5.2)
NetC35_2: MCU (U3.7), Interface (C35.2 R37.1 SW4.B)
NetC36_2: MCU (U3.5), Interface (C36.2 R38.1 SW4.A)
NetJ3_1: MCU (U3.13), Display (J3.1 R35.1)
NetJ3_2: MCU (U3.12), Display (J3.2 R36.1)
NetR17_1: MCU (U3.33), Ethernet (R17.1 U4.12)
NetR18_1: MCU (U3.36), Ethernet (R18.1 U4.11)
NetR20_2: MCU (U3.37), Ethernet (R20.2)
NetR21_2: MCU (U3.16), Ethernet (R21.2)
NetR42_1: MCU (U3.14), Interface (R42.1)
NetU3_8: MCU (U3.8), UART_RS485 (U5.4)
NetU3_9: MCU (U3.9), UART_RS485 (U5.3)
NetU3_10: MCU (U3.10), UART_RS485 (U5.2)
NetU3_11: MCU (U3.11), UART_RS485 (U5.1)
NetU3_23: MCU (U3.23), Ethernet (U4.18)
NetU3_26: MCU (U3.26), Ethernet (U4.17)
NetU3_30: MCU (U3.30), Ethernet (U4.16)
NetU3_31: MCU (U3.31), Ethernet (U4.13)